# EAGLE design N2xx_TRBSwitch_A (EAGLE 7.3.0)
This is a serial controlled TR and band switch controller for the N2xx series and any other device that provides an RS232 serial stream. The unit is designed for use with SoDaRadio (C) 2015 Matt Reilly -- kb1vc
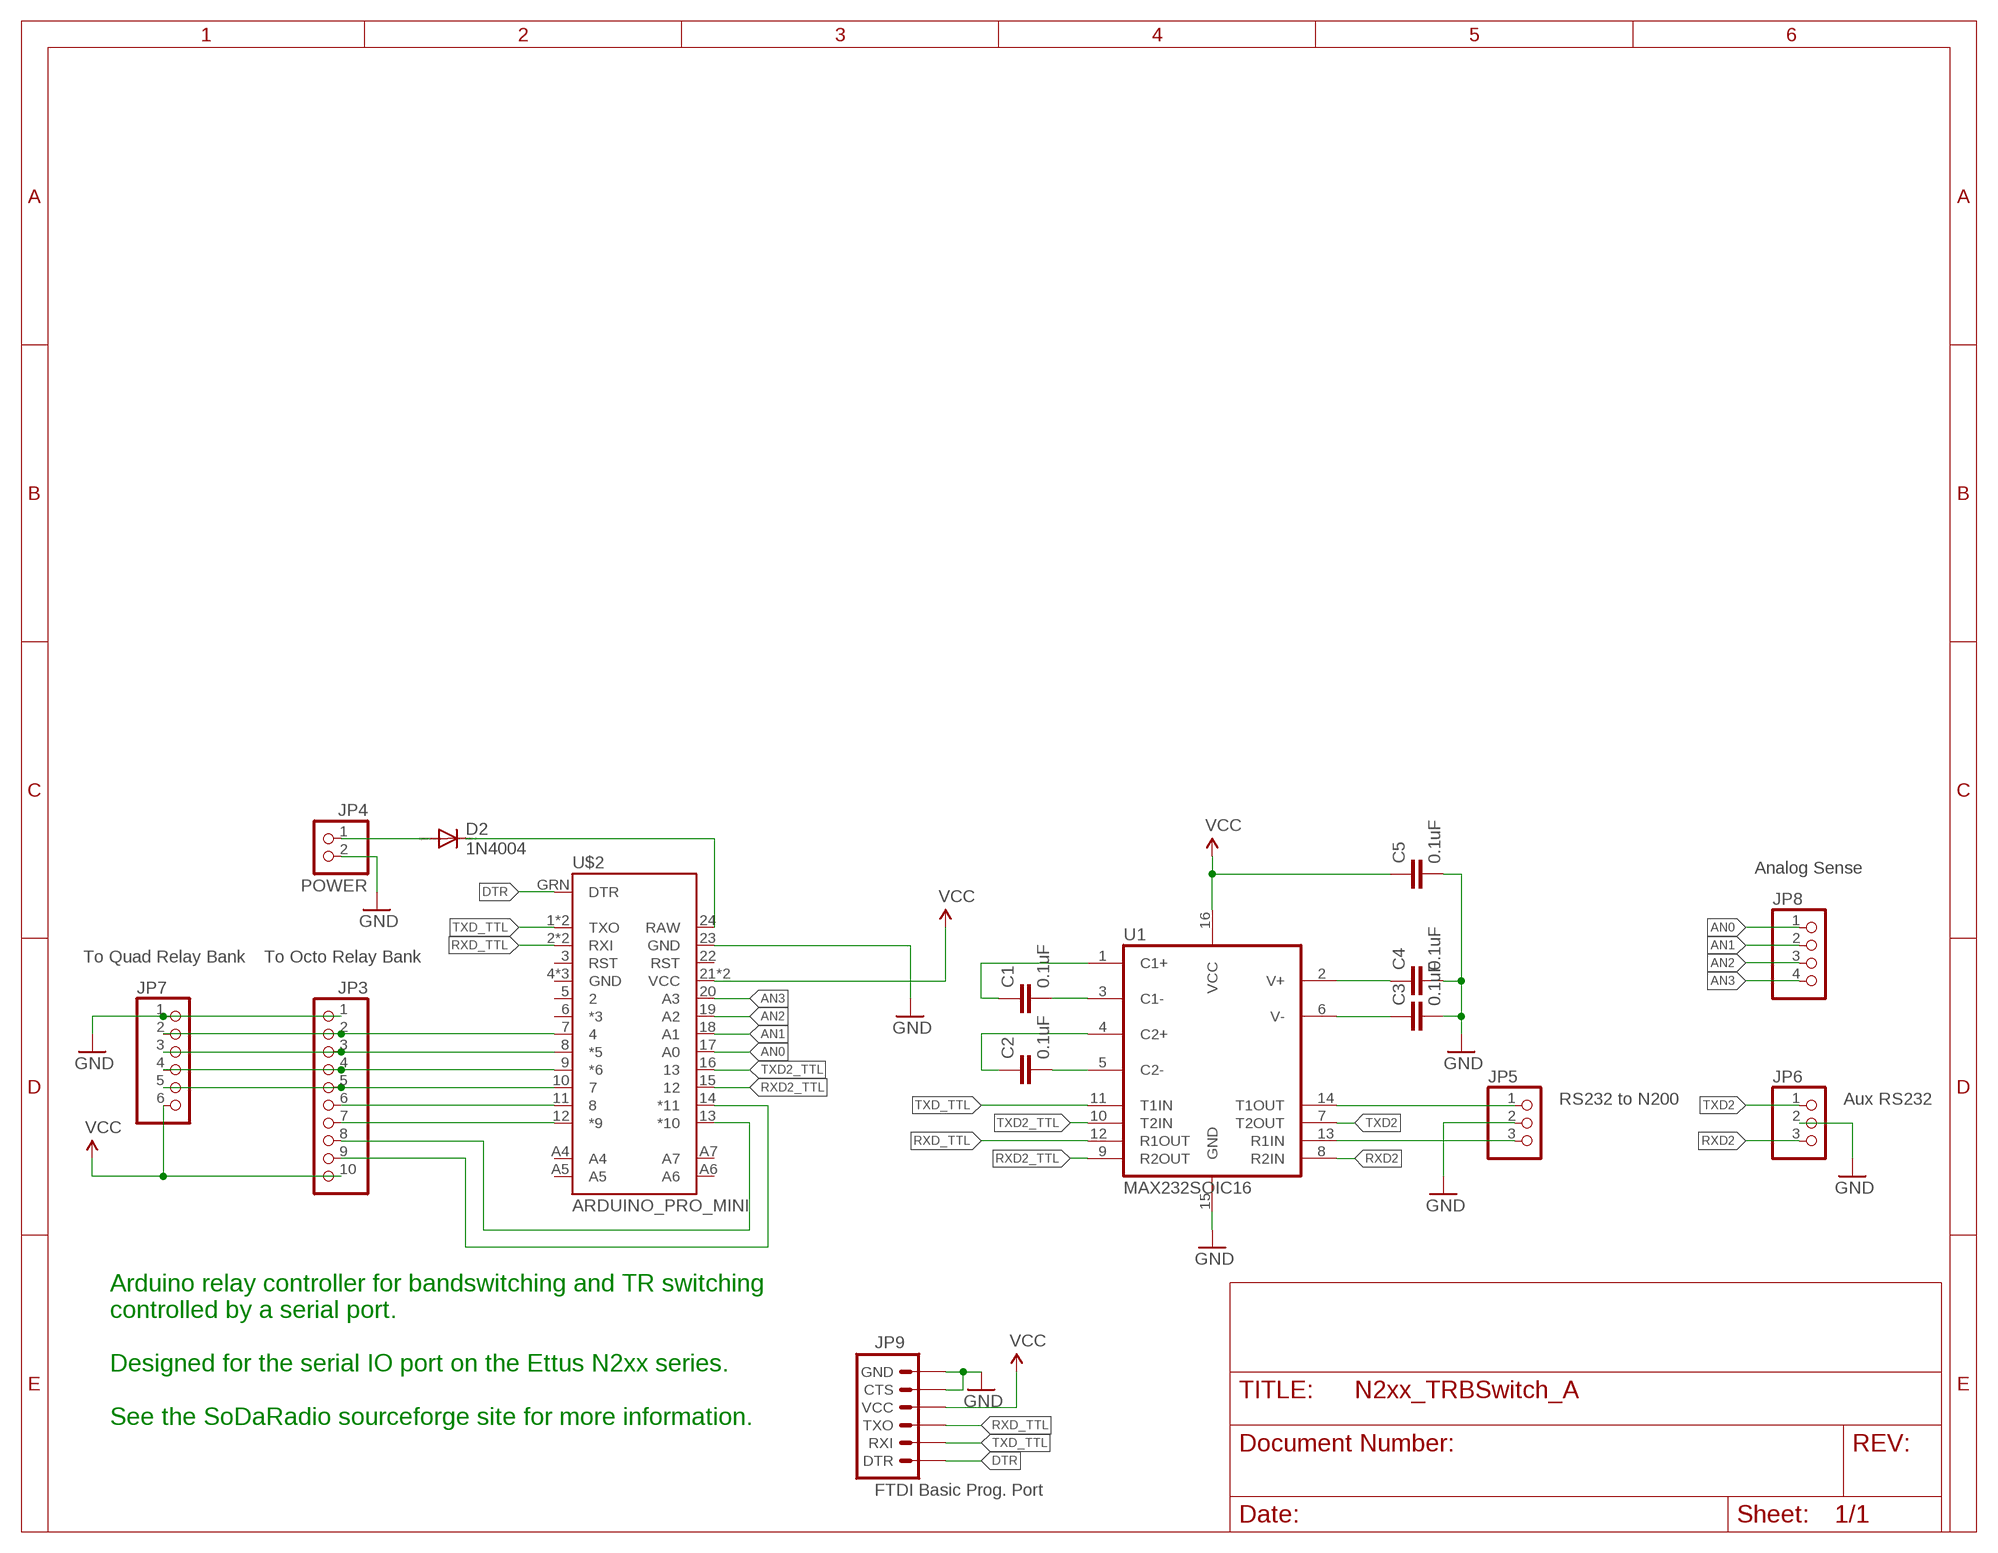
[diagram p0: schematic, sheet 1]

## Parts
C1  0.1uF  CAP0805  [0805]
C2  0.1uF  CAP0805  [0805]
C3  0.1uF  CAP0805  [0805]
C4  0.1uF  CAP0805  [0805]
C5  0.1uF  CAP0805  [0805]
D2  1N4004  [DO41-10]
JP3  To Octo Relay Bank  PINHD-1X10  [1X10]
JP4  POWER  PINHD-1X2  [1X02]
JP5  RS232 to N200  PINHD-1X3  [1X03]
JP6  Aux RS232  PINHD-1X3  [1X03]
JP7  To Quad Relay Bank  PINHD-1X6  [1X06]
JP8  Analog Sense  PINHD-1X4  [1X04]
JP9  FTDI Basic Prog. Port  ARDUINO_SERIAL_PROGRAMPTH  [1X06]
U1  MAX232SOIC16  [SO016]
U$2  ARDUINO_PRO_MINI  [ARDUINO_PRO_MINI]

## Nets
AN0: JP8.1 U$2.17(A0)
AN1: JP8.2 U$2.18(A1)
AN2: JP8.3 U$2.19(A2)
AN3: JP8.4 U$2.20(A3)
DTR: JP9.1(DTR) U$2.GRN(DTR)
GND: C3.2 C4.2 C5.2 JP3.1 JP4.2 JP5.2 JP6.2 JP7.1 JP9.5(CTS) JP9.6(GND) U1.15(GND) U$2.23(GND)
N$7: C1.2 U1.3(C1-)
N$8: C1.1 U1.1(C1+)
N$9: C2.1 U1.4(C2+)
N$10: C2.2 U1.5(C2-)
N$11: C3.1 U1.6(V-)
N$12: C4.1 U1.2(V+)
N$13: JP3.2 JP7.2 U$2.7
N$14: JP3.3 JP7.3 U$2.8(*5)
N$15: JP3.4 JP7.4 U$2.9(*6)
N$16: JP3.5 JP7.5 U$2.10
N$17: JP3.6 U$2.11
N$18: JP3.7 U$2.12(*9)
N$19: D2.A JP4.1
N$20: JP5.1 U1.14(T1OUT)
N$21: JP3.8 U$2.13(*10)
N$22: JP3.9 U$2.14(*11)
N$23: JP5.3 U1.13(R1IN)
N$24: D2.C U$2.24(RAW)
RXD2: JP6.3 U1.8(R2IN)
RXD2_TTL: U1.9(R2OUT) U$2.15
RXD_TTL: JP9.3(TXO) U1.12(R1OUT) U$2.2(RXI) U$2.RXI
TXD2: JP6.1 U1.7(T2OUT)
TXD2_TTL: U1.10(T2IN) U$2.16
TXD_TTL: JP9.2(RXI) U1.11(T1IN) U$2.1(TXO) U$2.TXO
VCC: C5.1 JP3.10 JP7.6 JP9.4(VCC) U1.16(VCC) U$2.21(VCC) U$2.VCC
Unconnected: U$2.3(RST) U$2.4(GND) U$2.5 U$2.6(*3) U$2.22(RST) U$2.A4 U$2.A5 U$2.A6 U$2.A7 U$2.BLK(GND) U$2.GND

## Notes on the sheet
- Arduino relay controller for bandswitching and TR switching
  controlled by a serial port. 
  
  Designed for the serial IO port on the Ettus N2xx series. 
  
  See the SoDaRadio sourceforge site for more information.

## Library data of the parts
C1-C5 = SparkFun-Capacitors:CAP: Capacitor Standard 0603 ceramic capacitor, and 0.1" leaded capacitor.
D2 = diode:1N4004: DIODE general purpose rectifier, 1 A
JP3 = pinhead:PINHD-1X10: PIN HEADER
JP4 = pinhead:PINHD-1X2: PIN HEADER
JP5 JP6 = pinhead:PINHD-1X3: PIN HEADER
JP7 = pinhead:PINHD-1X6: PIN HEADER
JP8 = pinhead:PINHD-1X4: PIN HEADER
JP9 = SparkFun-Connectors:ARDUINO_SERIAL_PROGRAM: FTDI connector footprints
U1 = SparkFun-DigitalIC:MAX232: RS232 Transceiver Very common IC. This is generically called 'MAX232', but works with the 3V equivalent MAX3232 generic ICs. Field tested and mother approved. Spark Fun Electronics SKU : COM-00316 (DIP) and COM-00589 (SMD); PROD_ID: IC-08171
U$2 = kb1vc_Arduino_Parts:ARDUINO_PRO_MINI

## Board
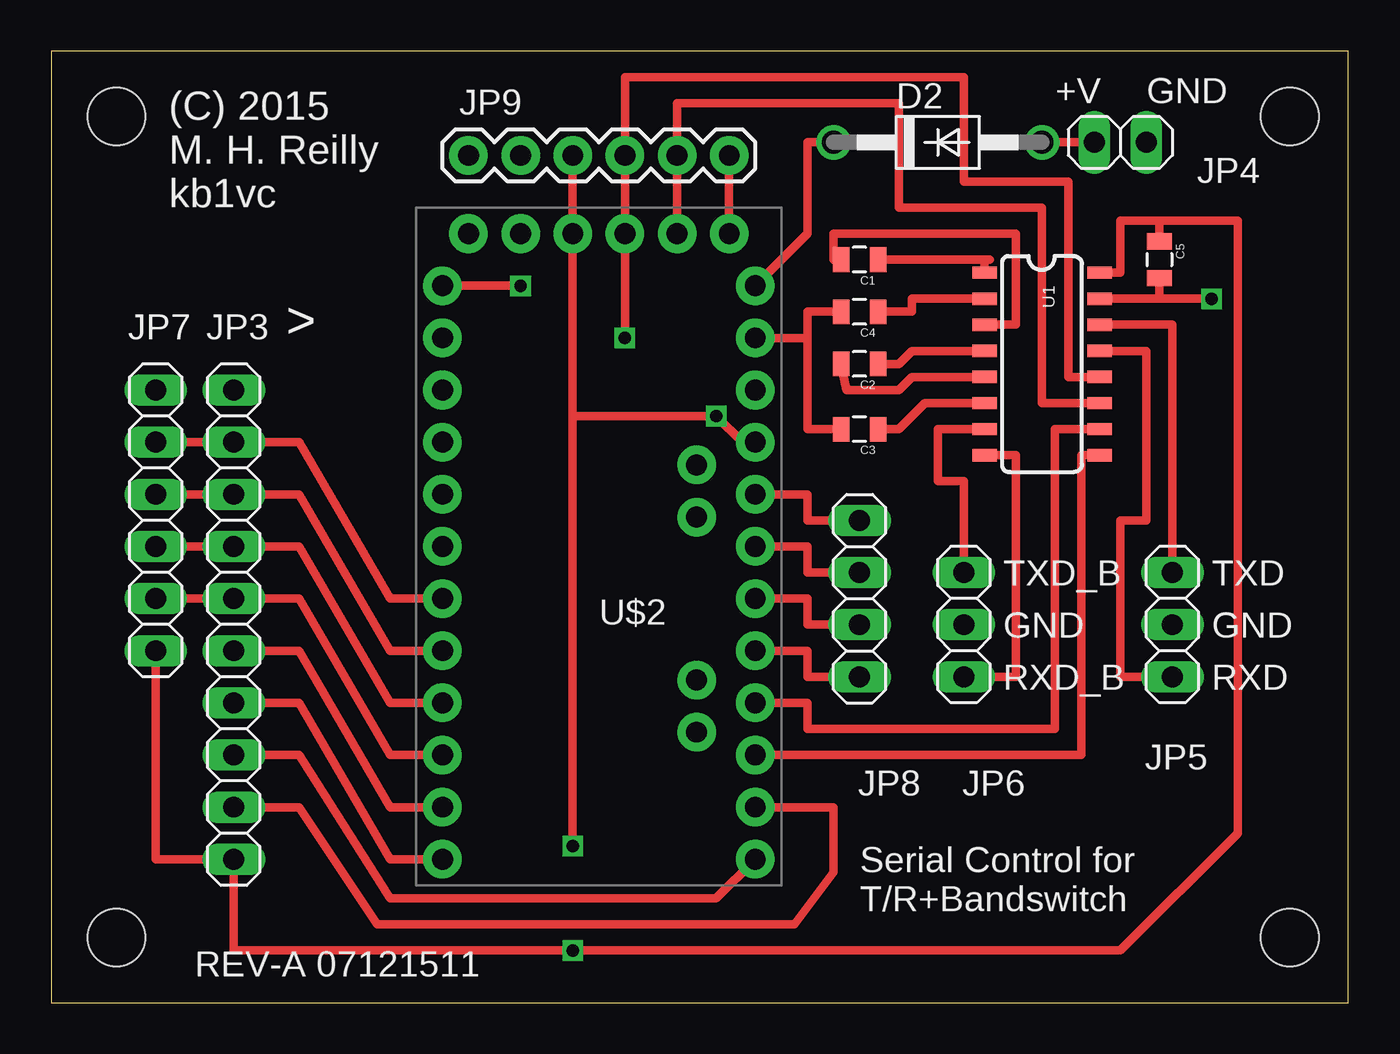
[diagram p1: board, top side]
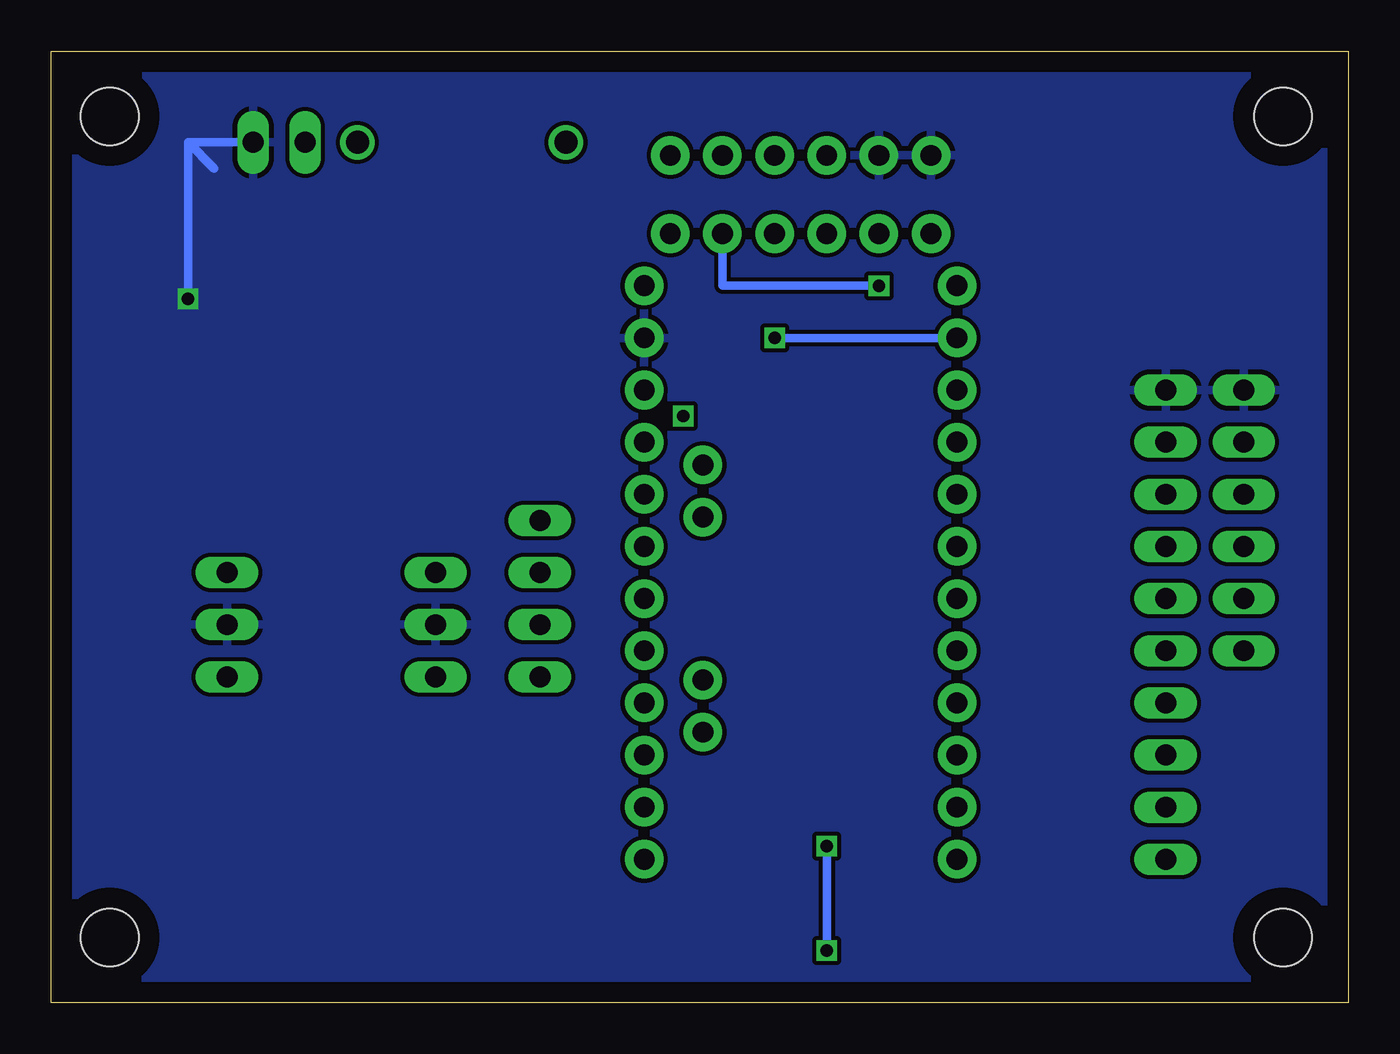
[diagram p2: board, bottom side, seen from below]

Size 63.17 x 46.34 mm. Coordinates in mm from the lower left corner, seen from the top.
Outline: 0,0 63.17,0 63.17,46.34 0,46.34 0,0
Copper layers (1*16): Top 0.035mm / dielectric 1.5mm / Bottom 0.035mm
Design rules "default": minimum track width 10mil, minimum drill 24mil, track to track 8mil, track to pad 8mil, pad to pad 8mil, via to via 8mil, smd to smd 8mil, copper to edge 40mil, drill to drill 8mil, minimum pad ring 10mil, minimum via ring 8mil, stop-mask expansion 4mil, vias tented up to drill 0mil, thermal gap 10mil
Holes 2.8 mm at 3.17,43.18 3.17,3.17 60.33,3.17 60.33,43.18

### Footprints (pad centres in the part's own frame; a part is rotated, then mirrored left to right if it is on the bottom)
0805 = smd 0.8 x 1.2: 1 -0.9,0; 2 0.9,0
DO41-10 = drill 1.118: A 5.08,0; C -5.08,0
1X10 = drill 1.016 long: 1 -11.43,0; 2 -8.89,0; 3 -6.35,0; 4 -3.81,0; 5 -1.27,0; 6 1.27,0; 7 3.81,0; 8 6.35,0; 9 8.89,0; 10 11.43,0
1X02 = drill 1.016 long: 1 -1.27,0; 2 1.27,0
1X03 = drill 1.016 long: 1 -2.54,0; 2 0,0; 3 2.54,0
1X06 = drill 1.016 long: 1 -6.35,0; 2 -3.81,0; 3 -1.27,0; 4 1.27,0; 5 3.81,0; 6 6.35,0
1X04 = drill 1.016 long: 1 -3.81,0; 2 -1.27,0; 3 1.27,0; 4 3.81,0
1X06' = drill 1.016 pad 1.88: 1 0,0; 2 2.54,0; 3 5.08,0; 4 7.62,0; 5 10.16,0; 6 12.7,0
SO016 = smd 0.6 x 1.2: 1 -4.445,-2.8; 2 -3.175,-2.8; 3 -1.905,-2.8; 4 -0.635,-2.8; 5 0.635,-2.8; 6 1.905,-2.8; 7 3.175,-2.8; 8 4.445,-2.8; 9 4.445,2.8; 10 3.175,2.8; 11 1.905,2.8; 12 0.635,2.8; 13 -0.635,2.8; 14 -1.905,2.8; 15 -3.175,2.8; 16 -4.445,2.8
ARDUINO_PRO_MINI = drill 1.016 pad 1.88: 1 -7.62,12.7; 2 -7.62,10.16; 3 -7.62,7.62; 4 -7.62,5.08; 5 -7.62,2.54; 6 -7.62,0; 7 -7.62,-2.54; 8 -7.62,-5.08; 9 -7.62,-7.62; 10 -7.62,-10.16; 11 -7.62,-12.7; 12 -7.62,-15.24; 13 7.62,-15.24; 14 7.62,-12.7; 15 7.62,-10.16; 16 7.62,-7.62; 17 7.62,-5.08; 18 7.62,-2.54; 19 7.62,0; 20 7.62,2.54; 21 7.62,5.08; 22 7.62,7.62; 23 7.62,10.16; 24 7.62,12.7; A4 4.763,1.429; A5 4.763,3.969; A6 4.763,-9.049; A7 4.763,-6.509; BLK -6.35,15.24; GND -3.81,15.24; GRN 6.35,15.24; RXI 1.27,15.24; TXO 3.81,15.24; VCC -1.27,15.24

### Placement (x,y rotation side)
C1  39.37,36.2 180 top
C2  39.37,31.11 180 top
C3  39.37,27.94 180 top
C4  39.37,33.66 180 top
C5  53.98,36.2 270 top
D2  43.18,41.91 0 top
JP3  8.89,18.41 270 top
JP4  52.07,41.91 0 top
JP5  54.61,18.41 270 top
JP6  44.45,18.41 270 top
JP7  5.08,23.5 270 top
JP8  39.37,19.68 90 top
JP9  FTDI Basic Prog. Port  [1X06']  33.02,41.27 180 top
U1  48.26,31.11 270 top
U$2  26.67,22.23 0 top

### Tracks (layer width: path | path; a pad name or v marks a point on that pad's centre or on a via)
AN0
  Top 0.406: U$2.17 36.83,17.14 36.83,15.88 JP8.1
AN1
  Top 0.406: U$2.18 36.83,19.68 36.83,18.41 JP8.2
AN2
  Top 0.406: U$2.19 36.83,22.23 36.83,20.95 JP8.3
AN3
  Top 0.406: U$2.20 36.83,24.77 36.83,23.5 JP8.4
DTR
  Top 0.406: U$2.GRN JP9.1
GND  (via drill 0.6)
  Top 0.406: C5.2 53.98,34.29 v56.52,34.29 U1.15 | C4.2 36.83,33.66 36.83,32.38 | C3.2 36.83,27.94 36.83,32.38 | U$2.23 36.83,32.38
  Bottom 0.406: JP4.2 56.52,41.91 | 56.52,41.91 55.24,40.64 | v56.52,34.29 56.52,41.91
  pour Bottom: 0.64,45.72 0.64,0.64 62.87,0.64 62.87,45.72
N$7
  Top 0.406: U1.3 46.99,33.02 46.99,37.47 38.1,37.47 38.1,36.2 C1.2
N$8
  Top 0.406: C1.1 45.46,36.2 | 45.72,36.2 45.46,36.2 | 45.46,36.2 U1.1
N$9
  Top 0.406: U1.4 41.91,31.75 41.27,31.11 C2.1
N$10
  Top 0.406: U1.5 41.91,30.48 41.27,29.84 38.73,29.84 C2.2
N$11
  Top 0.406: U1.6 42.55,29.21 41.27,27.94 C3.1
N$12
  Top 0.406: U1.2 41.91,34.29 41.91,33.66 C4.1
N$13
  Top 0.406: JP7.2 JP3.2 12.06,27.3 16.51,19.68 U$2.7
N$14
  Top 0.406: JP7.3 JP3.3 12.06,24.77 16.51,17.14 U$2.8
N$15
  Top 0.406: JP7.4 JP3.4 12.06,22.23 16.51,14.61 U$2.9
N$16
  Top 0.406: JP7.5 JP3.5 12.06,19.68 16.51,12.06 U$2.10
N$17
  Top 0.406: JP3.6 12.06,17.14 16.51,9.53 U$2.11
N$18
  Top 0.406: JP3.7 12.06,14.61 16.51,6.99 U$2.12
N$19
  Top 0.406: D2.A JP4.1
N$20
  Top 0.406: JP5.1 54.61,33.02 U1.14
N$21
  Top 0.406: JP3.8 12.06,12.06 16.51,5.08 32.38,5.08 U$2.13
N$22
  Top 0.406: JP3.9 12.06,9.53 15.88,3.81 36.2,3.81 38.1,6.35 38.1,9.53 U$2.14
N$23
  Top 0.406: JP5.3 52.07,15.88 52.07,23.5 53.34,23.5 53.34,31.75 U1.13
N$24
  Top 0.406: D2.C 36.83,41.91 36.83,37.47 U$2.24
RXD2
  Top 0.406: U1.8 46.99,26.67 46.99,15.88 JP6.3
RXD2_TTL
  Top 0.406: U1.9 50.16,26.67 50.16,12.06 U$2.15
RXD_TTL  (via drill 0.6)
  Top 0.406: v27.94,32.38 U$2.RXI JP9.3 27.94,45.09 44.45,45.09 44.45,40.01 49.53,40.01 49.53,30.48 U1.12
  Bottom 0.406: U$2.2 v27.94,32.38
TXD2
  Top 0.406: U1.7 43.18,27.94 43.18,25.4 44.45,25.4 JP6.1
TXD2_TTL
  Top 0.406: U1.10 48.9,27.94 48.9,13.34 36.83,13.34 36.83,14.61 U$2.16
TXD_TTL  (via drill 0.6)
  Top 0.406: U$2.TXO JP9.2 30.48,43.81 41.27,43.81 41.27,38.73 48.26,38.73 48.26,29.21 U1.11 | U$2.1 v22.86,34.92
  Bottom 0.406: v22.86,34.92 30.48,34.92 U$2.TXO
VCC  (via drill 0.6)
  Top 0.406: JP7.6 5.08,6.99 JP3.10 8.89,2.54 v25.4,2.54 52.07,2.54 57.78,8.26 57.78,38.1 53.98,38.1 | C5.1 53.98,38.1 | 53.98,38.1 52.07,38.1 52.07,35.56 U1.16 | 25.4,28.57 v32.38,28.57 33.66,27.3 U$2.21 | 25.4,28.57 v25.4,7.62 | JP9.4 U$2.VCC 25.4,28.57
  Bottom 0.406: v25.4,2.54 v25.4,7.62

### Text on the board
tNames: +V | GND | (C) 2015 / M. H. Reilly / kb1vc | > | TXD_B | TXD | GND | GND | RXD_B | RXD | Serial Control for / T/R+Bandswitch | REV-A 07121511